# EAGLE design Receiver (EAGLE 9.2.0)
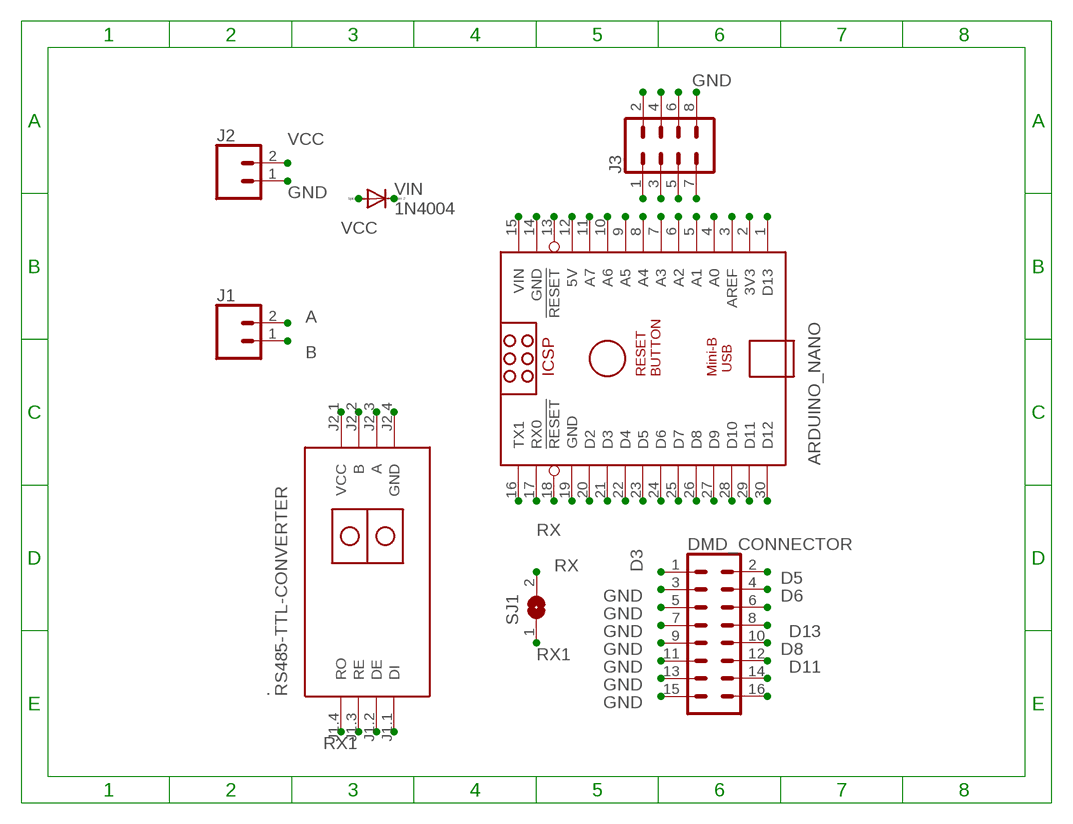
[diagram p0: schematic, sheet 1]

## Parts
.  RS485-TTL-CONVERTER  [RS485-TTL-CONVERTER]
ARDUINO_NANO  ARDUINO_NANO  [ARDUINO_NANO]
DMD_CONNECTOR  CONN_08X2_HEADER  [2X8]
J1  CONN_025MM  [SCREWTERMINAL-5MM-2]
J2  CONN_025MM  [SCREWTERMINAL-5MM-2]
J3  CONN_04X2  [2X4]
SJ1  SJW  [SJW]
VIN  1N4004  [DO41-10]

## Nets
A: ..J2.3(A) J1.2
A1: ARDUINO_NANO.5(A1) J3.7
A2: ARDUINO_NANO.6(A2) J3.5
A3: ARDUINO_NANO.7(A3) J3.3
A4: ARDUINO_NANO.8(A4) J3.1
B: ..J2.2(B) J1.1
D3: ARDUINO_NANO.21(D3) DMD_CONNECTOR.1
D5: ARDUINO_NANO.23(D5) DMD_CONNECTOR.2
D6: ARDUINO_NANO.24(D6) DMD_CONNECTOR.4
D7: ARDUINO_NANO.25(D7)
D8: ARDUINO_NANO.26(D8) DMD_CONNECTOR.10
D9: ARDUINO_NANO.27(D9)
D11: ARDUINO_NANO.29(D11) DMD_CONNECTOR.12
D13: ARDUINO_NANO.1(D13) DMD_CONNECTOR.8
GND: ..J1.2(DE) ..J1.3(RE) ..J2.4(GND) ARDUINO_NANO.14(GND) DMD_CONNECTOR.3 DMD_CONNECTOR.5 DMD_CONNECTOR.7 DMD_CONNECTOR.9 DMD_CONNECTOR.11 DMD_CONNECTOR.13 DMD_CONNECTOR.15 J2.1 J3.2 J3.4 J3.6 J3.8
N$4: ARDUINO_NANO.28(D10)
N$10: ..J1.1(DI)
N$12: DMD_CONNECTOR.6
N$16: DMD_CONNECTOR.14
N$17: DMD_CONNECTOR.16
N$23: ARDUINO_NANO.16(TX1)
N$25: ARDUINO_NANO.18(!RESET)
N$26: ARDUINO_NANO.19(GND)
N$27: ARDUINO_NANO.20(D2)
N$29: ARDUINO_NANO.22(D4)
N$37: ARDUINO_NANO.30(D12)
N$39: ARDUINO_NANO.2(3V3)
N$40: ARDUINO_NANO.3(AREF)
N$41: ARDUINO_NANO.4(A0)
N$46: ARDUINO_NANO.9(A5)
N$47: ARDUINO_NANO.10(A6)
N$48: ARDUINO_NANO.11(A7)
N$49: ARDUINO_NANO.12(5V)
N$50: ARDUINO_NANO.13(!RESET)
RX: ARDUINO_NANO.17(RX0) SJ1.2
RX1: ..J1.4(RO) SJ1.1
VCC: J2.2 VIN.A
VIN: ..J2.1(VCC) ARDUINO_NANO.15(VIN) VIN.C

## Library data of the parts
. = diy-modules:RS485-TTL-CONVERTER: RS485 to TTL converter based on MAX485 chip
ARDUINO_NANO = ArduinoNanoV30:ARDUINO_NANO: Arduino Nano V3.0 Overview: The Arduino Nano is a small, complete, and breadboard-friendly board based on the ATmega328 (Arduino Nano 3.x) or ATmega168 (Arduino Nano 2.x). It has more or less the same functionality of the Arduino Duemilanove, but in a different package. It lacks only a DC power jack, and works with a Mini-B USB cable instead of a standard one. The Nano was designed and is being produced by Gravitech. Specifications: Microcontroller Atmel ATmega168 or ATmega328 Operating Voltage (logic level) 5 V Input Voltage (recommended) 7-12 V Input Voltage (limits) 6-20 V Digital I/O Pins 14 (of which 6 provide PWM output) Analog Input Pins 8 DC Current per I/O Pin 40 mA Flash Memory 16 KB (ATmega168) or 32 KB (ATmega328) of which 2 KB used by bootloader SRAM 1 KB (ATmega168) or 2 KB (ATmega328) EEPROM 512 bytes (ATmega168) or 1 KB (ATmega328) Clock Speed 16 MHz Dimensions 0.73" x 1.70" Length 45 mm Width 18 mm Weigth 5 g Power: The Arduino Nano can be powered via the Mini-B USB connection, 6-20V unregulated external power supply (pin 30), or 5V regulated external power supply (pin 27). The power source is automatically selected to the highest voltage source. Memory: The ATmega168 has 16 KB of flash memory for storing code (of which 2 KB is used for the bootloader); the ATmega328 has 32 KB, (also with 2 KB used for the bootloader). The ATmega168 has 1 KB of SRAM and 512 bytes of EEPROM (which can be read and written with the EEPROM library); the ATmega328 has 2 KB of SRAM and 1 KB of EEPROM. Input and Output: Each of the 14 digital pins on the Nano can be used as an input or output, using pinMode(), digitalWrite(), and digitalRead() functions. They operate at 5 volts. Each pin can provide or receive a maximum of 40 mA and has an internal pull-up resistor (disconnected by default) of 20-50 kOhms. In addition, some pins have specialized functions. Visit Arduino - ArduinoBoardNano <https://www.arduino.cc/en/Main/ArduinoBoardNano>
DMD_CONNECTOR = SparkFun-Connectors:CONN_08X2: Multi connection point. Often used as Generic Header-pin footprint for 0.1 inch spaced/style header connections You can populate with any combo of single row headers, but if you'd like an exact match, check this: Header - 2x8 (Male, 0.1") <https://www.sparkfun.com/products/13156> (PRT-13156) On any of the 0.1 inch spaced packages, you can populate with these: Break Away Headers - Straight <https://www.sparkfun.com/products/116> (PRT-00116) Break Away Male Headers - Right Angle <https://www.sparkfun.com/products/553> (PRT-00553) Female Headers <https://www.sparkfun.com/products/115> (PRT-00115) Break Away Headers - Machine Pin <https://www.sparkfun.com/products/117> (PRT-00117) Break Away Female Headers - Swiss Machine Pin <https://www.sparkfun.com/products/743> (PRT-00743)
J1 J2 = SparkFun-Connectors:CONN_02: Multi connection point. Often used as Generic Header-pin footprint for 0.1 inch spaced/style header connections On any of the 0.1 inch spaced packages, you can populate with these: Break Away Headers - Straight <https://www.sparkfun.com/products/116> (PRT-00116) Break Away Male Headers - Right Angle <https://www.sparkfun.com/products/553> (PRT-00553) Female Headers <https://www.sparkfun.com/products/115> (PRT-00115) Break Away Headers - Machine Pin <https://www.sparkfun.com/products/117> (PRT-00117) Break Away Female Headers - Swiss Machine Pin <https://www.sparkfun.com/products/743> (PRT-00743) For SCREWTERMINALS and SPRING TERMINALS visit here: Screw Terimnals on SparkFun.com <https://www.sparkfun.com/search/results?term=Screw+Terminals> (5mm/3.5mm/2.54mm spacing) This device is also useful as a general connection point to wire up your design to another part of your project. Our various solder wires solder well into these plated through hole pads. Hook-Up Wire - Assortment (Stranded, 22 AWG) <https://www.sparkfun.com/products/11375> (PRT-11375) Hook-Up Wire - Assortment (Solid Core, 22 AWG) <https://www.sparkfun.com/products/11367> (PRT-11367) View the entire wire category on our website here <https://www.sparkfun.com/categories/141> Special notes: Molex polarized connector foot print use with: PRT-08233 with associated crimp pins and housings. 2.54_SCREWTERM for use with PRT-10571. 3.5mm Screw Terminal footprints for PRT-08084 5mm Screw Terminal footprints for use with PRT-08432; SF_SKU: PRT-08432
J3 = SparkFun-Connectors:CONN_04X2: Multi connection point. Often used as Generic Header-pin footprint for 0.1 inch spaced/style header connections On any of the 0.1 inch spaced packages, you can populate with these: Break Away Headers - Straight <https://www.sparkfun.com/products/116> (PRT-00116) Break Away Male Headers - Right Angle <https://www.sparkfun.com/products/553> (PRT-00553) Female Headers <https://www.sparkfun.com/products/115> (PRT-00115) Break Away Headers - Machine Pin <https://www.sparkfun.com/products/117> (PRT-00117) Break Away Female Headers - Swiss Machine Pin <https://www.sparkfun.com/products/743> (PRT-00743)
SJ1 = jumper:SJ: SMD solder JUMPER
VIN = diode:1N4004: DIODE general purpose rectifier, 1 A

## Board
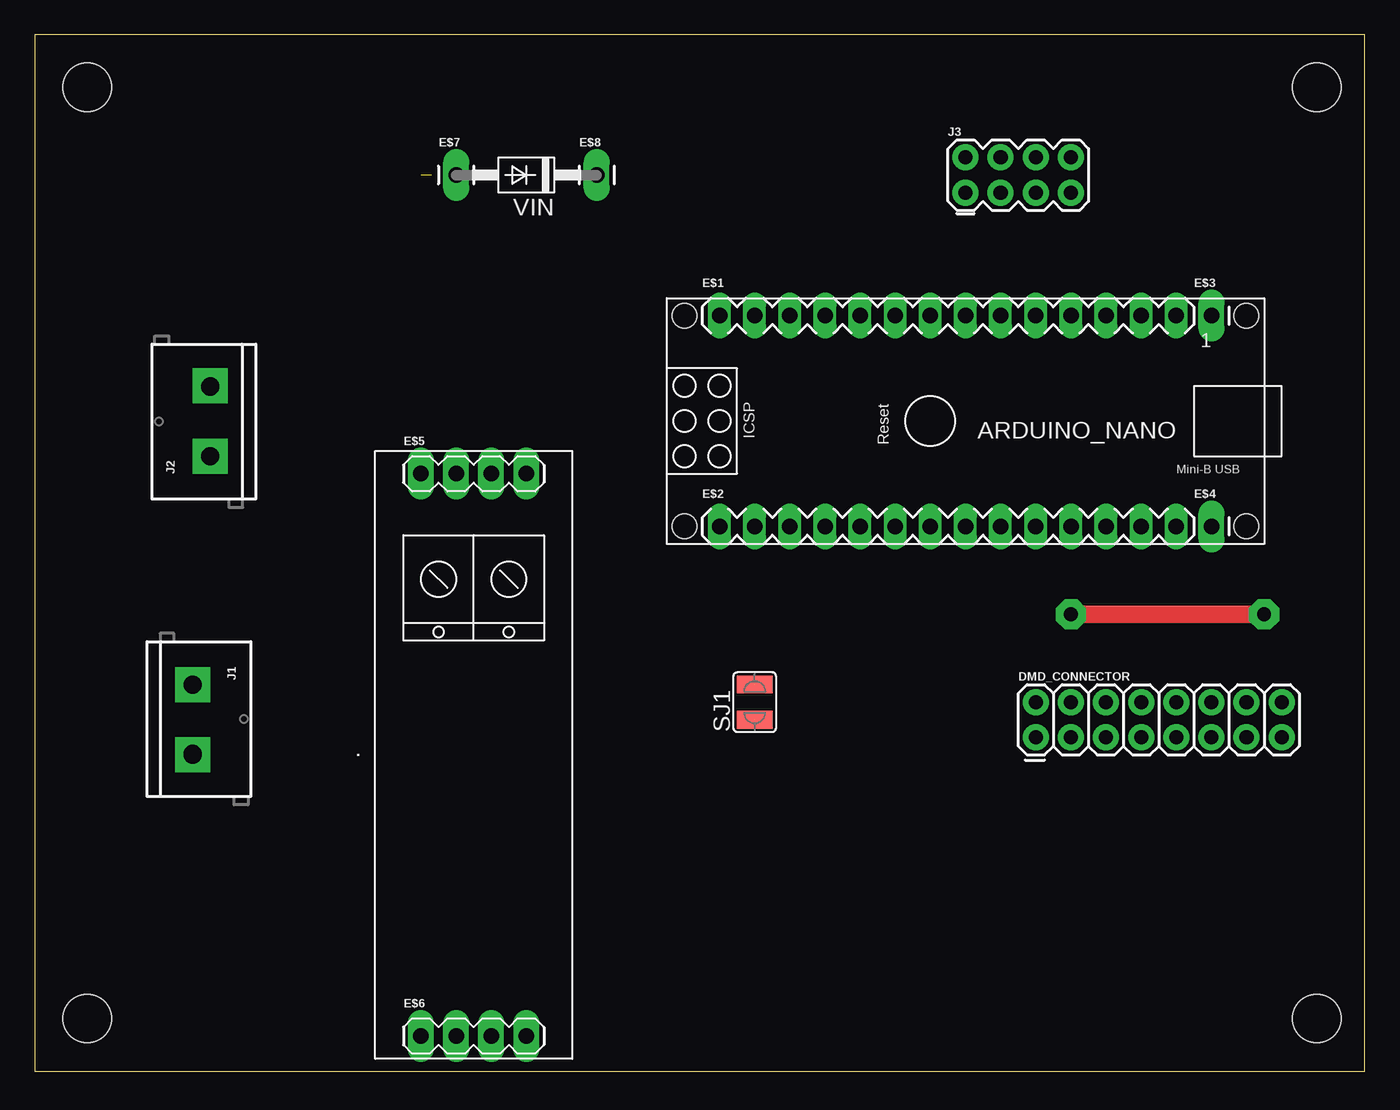
[diagram p1: board, top side]
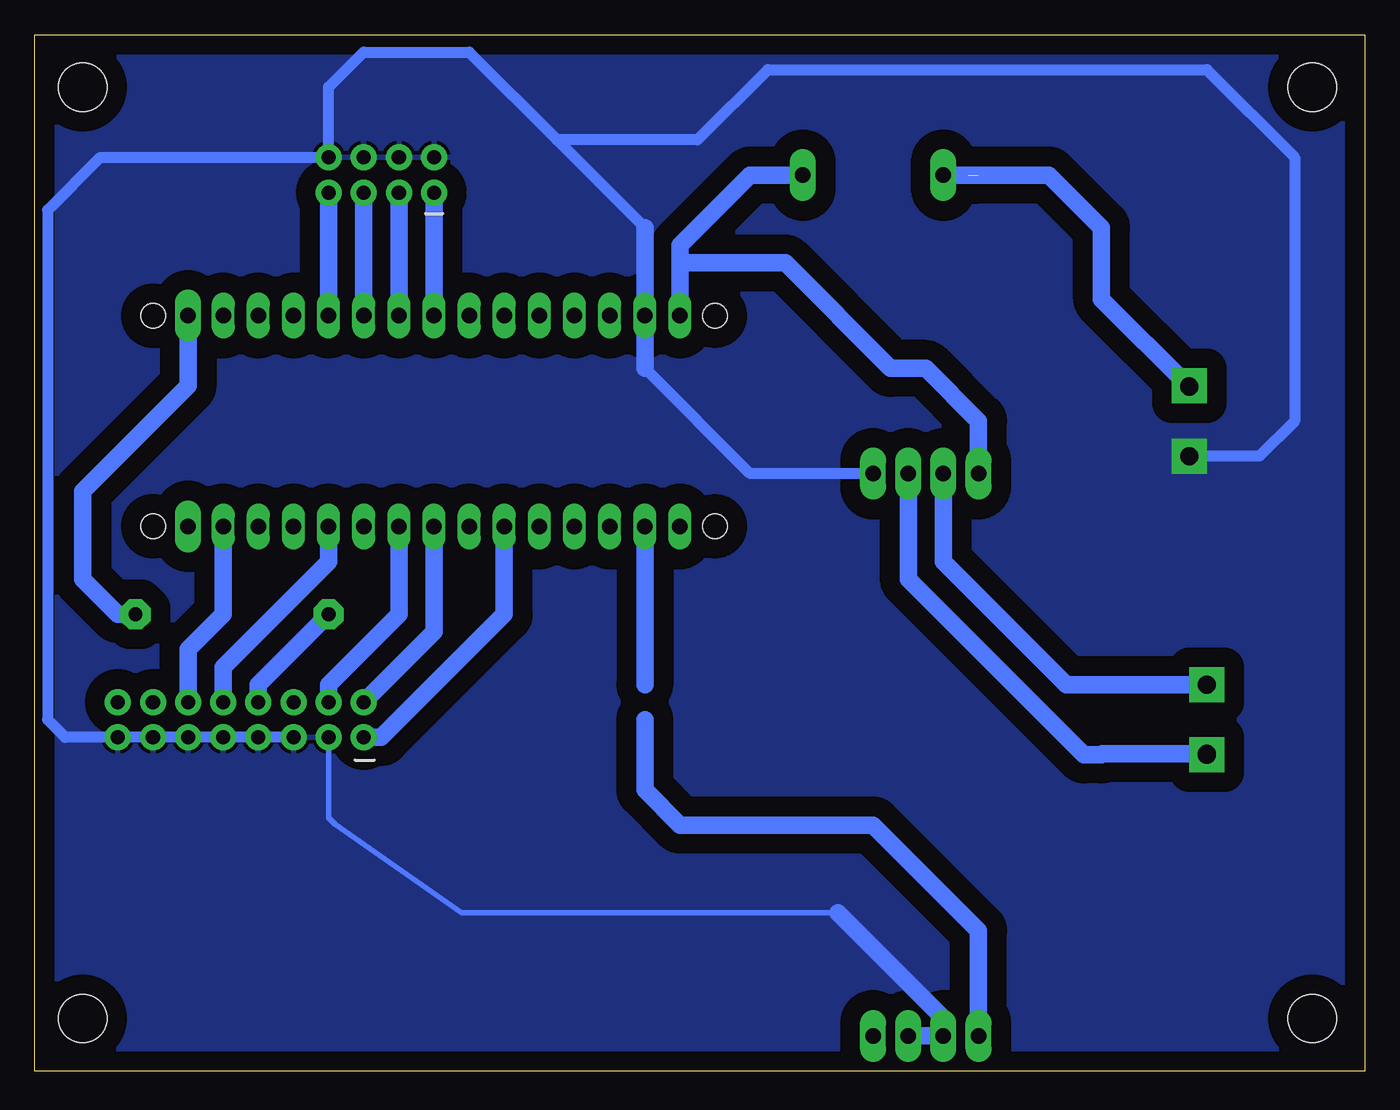
[diagram p2: board, bottom side, seen from below]

Size 96.19 x 74.92 mm. Coordinates in mm from the lower left corner, seen from the top.
Outline: 0,0 96.19,0 96.19,74.92 0,74.92 0,0
Copper layers (1*16): Top 0.035mm / dielectric 1.5mm / Bottom 0.035mm
Design rules "default": minimum track width 10mil, minimum drill 24mil, track to track 8mil, track to pad 8mil, pad to pad 8mil, via to via 8mil, smd to smd 8mil, copper to edge 40mil, drill to drill 8mil, minimum pad ring 10mil, minimum via ring 8mil, stop-mask expansion 4mil, vias tented up to drill 0mil, thermal gap 10mil
Holes 3.5 mm at 3.81,71.12 92.71,71.12 92.71,3.81 3.81,3.81

### Footprints (pad centres in the part's own frame; a part is rotated, then mirrored left to right if it is on the bottom)
RS485-TTL-CONVERTER = drill 1 square: J1.1 -20.32,-3.81; J2.1 20.32,3.81 | drill 1: J1.2 -20.32,-1.27; J1.3 -20.32,1.27; J1.4 -20.32,3.81; J2.2 20.32,1.27; J2.3 20.32,-1.27; J2.4 20.32,-3.81
ARDUINO_NANO = drill 0.8 square: 1 -20.32,-7.62 | drill 0.8: 2 -17.78,-7.62; 3 -15.24,-7.62; 4 -12.7,-7.62; 5 -10.16,-7.62; 6 -7.62,-7.62; 7 -5.08,-7.62; 8 -2.54,-7.62; 9 0,-7.62; 10 2.54,-7.62; 11 5.08,-7.62; 12 7.62,-7.62; 13 10.16,-7.62; 14 12.7,-7.62; 15 15.24,-7.62; 16 15.24,7.62; 17 12.7,7.62; 18 10.16,7.62; 19 7.62,7.62; 20 5.08,7.62; 21 2.54,7.62; 22 0,7.62; 23 -2.54,7.62; 24 -5.08,7.62; 25 -7.62,7.62; 26 -10.16,7.62; 27 -12.7,7.62; 28 -15.24,7.62; 29 -17.78,7.62; 30 -20.32,7.62 | hole 1.778: -22.86,-7.62; -22.86,7.62; 17.78,7.62; 17.78,-7.62
2X8 = drill 1.016 pad 1.88: 1 0,0; 2 0,2.54; 3 2.54,0; 4 2.54,2.54; 5 5.08,0; 6 5.08,2.54; 7 7.62,0; 8 7.62,2.54; 9 10.16,0; 10 10.16,2.54; 11 12.7,0; 12 12.7,2.54; 13 15.24,0; 14 15.24,2.54; 15 17.78,0; 16 17.78,2.54
1X14-LONGPADS = drill 1.118 long: 1 0,0; 2 2.54,0; 3 5.08,0; 4 7.62,0; 5 10.16,0; 6 12.7,0; 7 15.24,0; 8 17.78,0; 9 20.32,0; 10 22.86,0; 11 25.4,0; 12 27.94,0; 13 30.48,0; 14 33.02,0
1X01_LONGPAD = drill 1.118 pad 1.88 long: 1 0,0
1X04_LONGPADS = drill 1.118 pad 1.88 long: 1 0,0; 2 2.54,0; 3 5.08,0; 4 7.62,0
SCREWTERMINAL-5MM-2 = drill 1.3 pad 2.032 square: 1 0,0 | drill 1.3 pad 2.032: 2 5,0
2X4 = drill 1.016 pad 1.88: 1 -3.81,-1.27; 2 -3.81,1.27; 3 -1.27,-1.27; 4 -1.27,1.27; 5 1.27,-1.27; 6 1.27,1.27; 7 3.81,-1.27; 8 3.81,1.27
SJW = smd 1.27 x 2.54: 1 -1.27,0; 2 1.27,0
DO41-10 = drill 1.118: A 5.08,0; C -5.08,0

### Placement (x,y rotation side)
.  31.75,22.86 90 top
ARDUINO_NANO  64.77,46.99 180 top
DMD_CONNECTOR  72.39,24.13 0 top
E$1  [1X14-LONGPADS]  49.53,54.61 0 top
E$2  [1X14-LONGPADS]  49.53,39.37 0 top
E$3  [1X01_LONGPAD]  85.09,54.61 0 top
E$4  [1X01_LONGPAD]  85.09,39.37 0 top
E$5  [1X04_LONGPADS]  27.94,43.18 0 top
E$6  [1X04_LONGPADS]  27.94,2.54 0 top
E$7  [1X01_LONGPAD]  30.48,64.77 0 top
E$8  [1X01_LONGPAD]  40.64,64.77 0 top
J1  11.43,27.94 270 top
J2  12.7,44.45 90 top
J3  71.12,64.77 0 top
SJ1  52.07,26.67 90 top
VIN  35.56,64.77 180 top

### Tracks (layer width: path | path; a pad name or v marks a point on that pad's centre or on a via)
A
  Bottom 1.27: J1.2 18.97,22.94 19.05,22.86 20.32,22.86 33.02,35.56 ..J2.3
A1
  Bottom 1.27: ARDUINO_NANO.5 J3.7
A2
  Bottom 1.27: ARDUINO_NANO.6 J3.5
A3
  Bottom 1.27: ARDUINO_NANO.7 J3.3
A4
  Bottom 1.27: ARDUINO_NANO.8 J3.1
B
  Bottom 1.27: J1.1 21.59,27.94 30.48,36.83 ..J2.2
D3
  Bottom 1.27: DMD_CONNECTOR.1 71.12,24.13 62.23,33.02 ARDUINO_NANO.21
D5
  Bottom 1.27: DMD_CONNECTOR.2 67.31,31.75 ARDUINO_NANO.23
D6
  Bottom 1.27: DMD_CONNECTOR.4 74.93,27.94 69.85,33.02 ARDUINO_NANO.24
D8
  Bottom 1.27: DMD_CONNECTOR.10 82.55,29.21 74.93,36.83 ARDUINO_NANO.26
D11
  Bottom 1.27: DMD_CONNECTOR.12 85.09,30.48 82.55,33.02 ARDUINO_NANO.29
D13  (via drill 0.9 pad 2.18, 1)
  Top 1.27: v88.9,33.02 v74.93,33.02
  Bottom 1.27: DMD_CONNECTOR.8 80.01,27.94 v74.93,33.02 | ARDUINO_NANO.1 85.09,49.53 92.71,41.91 92.71,35.56 90.17,33.02 v88.9,33.02
GND  (via drill 1.27 pad 2.54)
  Bottom 0.406: 38.1,11.43 65.31,11.43 74.46,17.83 74.93,18.3 DMD_CONNECTOR.3
  Bottom 0.813: DMD_CONNECTOR.5 93.98,24.13 95.25,25.4 95.25,62.23 91.44,66.04 J3.8 74.93,71.12 72.39,73.66 64.77,73.66 58.42,67.31 | 58.42,67.31 52.07,60.96 | ..J2.4 44.45,43.18 52.07,50.8 | 58.42,67.31 48.26,67.31 43.18,72.39 11.43,72.39 5.08,66.04 5.08,46.99 7.62,44.45 J2.1
  Bottom 1.016: ..J1.3 30.48,3.81
  Bottom 1.27: ..J1.2 ..J1.3 | 30.48,3.81 38.1,11.43 | 52.07,60.96 ARDUINO_NANO.14 52.07,50.8
  other vias: 12.7,44.45
  pour Bottom (isolate 1.422): 0,74.93 96.52,74.93 96.52,-0.73 0,-0.73
N$1  (via drill 1.27 pad 2.54)
  other vias: 12.7,49.53
N$2  (via drill 1.27 pad 2.54)
  other vias: 11.43,27.94
N$3  (via drill 1.27 pad 2.54)
  other vias: 11.43,22.86
RX  (1 unrouted)
  Bottom 1.27: ARDUINO_NANO.17 SJ1.2
RX1  (1 unrouted)
  Bottom 1.27: ..J1.4 27.94,10.16 35.56,17.78 49.53,17.78 52.07,20.32 SJ1.1
VCC  (1 unrouted)
  Bottom 1.27: J2.2 19.05,55.8 19.05,60.96 22.86,64.77 26.67,64.77 28.7,64.77 | VIN.A 27.94,64.77
VIN
  Bottom 1.27: VIN.C 44.45,64.77 49.53,59.69 ARDUINO_NANO.15 49.53,58.42 41.91,58.42 34.29,50.8 31.75,50.8 27.94,46.99 ..J2.1